# Altium schematic sheet MSU_and_periphery.SchDoc
size A4; SheetNumber: 3; SheetTotal: 3
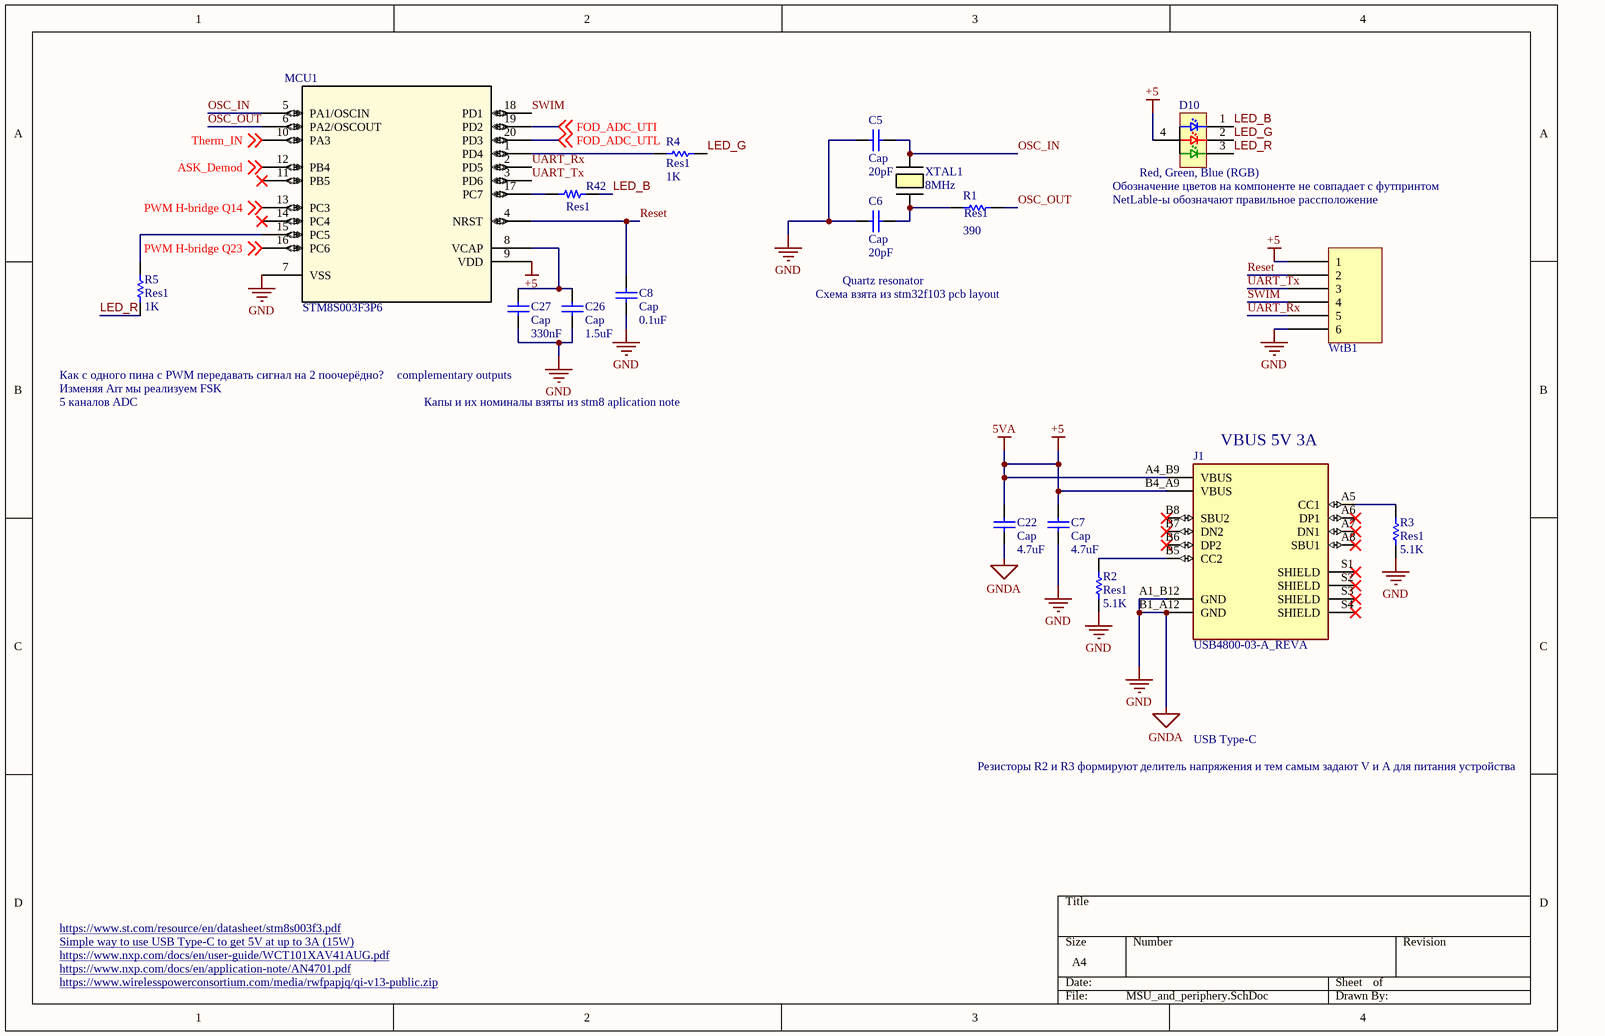
[diagram p0: MSU_and_periphery.SchDoc]

## Parts
C5  Cap  value 20pF  [CAP 0402_1005]
C6  Cap  value 20pF  [CAP 0402_1005]
C7  Cap  value 4.7uF  [CAP 0402_1005]
C8  Cap  value 0.1uF  [CAP 0402_1005]
C22  Cap  value 4.7uF  [CAP 0402_1005]
C26  Cap  value 1.5uF  [CAP 0603_1608]
C27  Cap  value 330nF  [CAP 0603_1608]
D10  Red, Green, Blue (RGB)  [Citizen CL-505S-X-SD-T]
J1  USB4800-03-A_REVA  [GCT_USB4800-03-A_REVA]
MCU1  STM8S003F3P6  [TSSOP20]
R1  Res1  value 390  [RES 0603_1608]
R2  Res1  value 5.1K  [RES 0402_1005]
R3  Res1  value 5.1K  [RES 0402_1005]
R4  Res1  value 1K  [RES 0402_1005]
R5  Res1  value 1K  [RES 0402_1005]
R42  Res1  [RES 0402_1005]
WtB1  (no value)  [6W_connector]  (no BOM)
XTAL1  8MHz  [NDK NX5032GA]

## Nets
+5: C7.1 C22.1 D10.4(A3) J1.A4_B9(VBUS) J1.B4_A9(VBUS) MCU1.9(VDD) WtB1.1  [also labelled 5VA]
GND: C5.2 C6.2 C7.2 C8.1 C22.2 C26.2 C27.1 J1.A1_B12(GND) J1.B1_A12(GND) MCU1.7(VSS) R2.2 R3.2 WtB1.6  [also labelled GNDA]
ASK_Demod: MCU1.12(PB4) ; off-sheet ASK_Demod
FOD_ADC_UTI: MCU1.19(PD2) ; off-sheet FOD_ADC_UTI
FOD_ADC_UTL: MCU1.20(PD3) ; off-sheet FOD_ADC_UTL
LED_B: D10.1(C1) R42.2
LED_G: D10.2(C2) R4.1
LED_R: D10.3(C3) R5.1
OSC_IN: C5.1 MCU1.5(PA1/OSCIN) XTAL1.1
OSC_OUT: MCU1.6(PA2/OSCOUT) R1.2
PWM H-bridge Q14: MCU1.13(PC3) ; off-sheet PWM H-bridge Q14
PWM H-bridge Q23: MCU1.16(PC6) ; off-sheet PWM H-bridge Q23
Reset: C8.2 MCU1.4(NRST) WtB1.2
SWIM: MCU1.18(PD1) WtB1.4
Therm_IN: MCU1.10(PA3) ; off-sheet Therm_IN
UART_Rx: MCU1.2(PD5) WtB1.5
UART_Tx: MCU1.3(PD6) WtB1.3
NetC6_1: C6.1 R1.1 XTAL1.2
NetC26_1: C26.1 C27.2 MCU1.8(VCAP)
NetJ1_A5: J1.A5(CC1) R3.1
NetJ1_B5: J1.B5(CC2) R2.1
NetMCU1_1: MCU1.1(PD4) R4.2
NetMCU1_15: MCU1.15(PC5) R5.2
NetMCU1_17: MCU1.17(PC7) R42.1

Not connected (* = marked no-connect by the designer): J1 A6(DP1)* A7(DN1)* A8(SBU1)* B6(DP2)* B7(DN2)* B8(SBU2)* S1(SHIELD)* S2(SHIELD)* S3(SHIELD)* S4(SHIELD)*; MCU1 11(PB5)* 14(PC4)*

## Notes on the sheet
- (near D10) Обозначение цветов на компоненте не совпадает с футпринтом
- NetLable-ы обозначают правильное рассположение
- Схема взята из stm32f103 pcb layout
- Quartz resonator
- Как с одного пина с PWM передавать сигнал на 2 поочерёдно?
- complementary outputs
- Изменяя Arr мы реализуем FSK
- 5 каналов ADC
- Капы и их номиналы взяты из stm8 aplication note
- (near J1) VBUS 5V 3A
- Резисторы R2 и R3 формируют делитель напряжения и тем самым задают V и A для питания устройства
- USB Type-C
- https://www.nxp.com/docs/en/application-note/AN4701.pdf
- https://www.nxp.com/docs/en/user-guide/WCT101XAV41AUG.pdf
- Simple way to use USB Type-C to get 5V at up to 3A (15W) <https://forum.digikey.com/t/simple-way-to-use-usb-type-c-to-get-5v-at-up-to-3a-15w/7016>
- https://www.st.com/resource/en/datasheet/stm8s003f3.pdf
- https://www.wirelesspowerconsortium.com/media/rwfpapjq/qi-v13-public.zip

## Library data of the parts
C5-C8 C22 C26 C27 = Cap: Capacitor; Published: 8-Jun-2000; LatestRevisionDate: 17-Jul-2002; LatestRevisionNote: Re-released for DXP Platform.; PackageReference: RAD-0.3; Publisher: Altium Limited; PackageDescription: Radial Cap, Thru-Hole; 2 Leads; 0.3 in Pin Spacing
D10 = CL-505S-X-SD-T: LED TRI TOP FIRING 1.0 X 1.0; Manufacturer: Citizen; Configuration: Common Anode; Current - Test: 5mA Red, 5mA Green, 5mA Blue; Lens Color: 0.26mm; Lens Size: 1.00mm; Lens Style: Square with Flat Top; Millicandela Rating: 40mcd Red, 220mcd Green, 65mcd Blue; Voltage - Forward (Vf) (Typ): 1.85V Red, 2.7V Green, 2.75V Blue; Wavelength - Dominant: 615nm Red, 530nm Green, 470nm Blue; Part Number: CL-505S-X-SD-T; Color: Red, Green, Blue (RGB); ComponentLink1Description: Datasheet; ComponentLink1URL: http://ce.citizen.co.jp/up_img/product/sQNrj4RlM7o2/CL-505S_e.pdf; ComponentLink2Description: DigiKey Link; ComponentLink2URL: http://digikey.com/product-detail/en/citizen/CL-505S-X-SD-T/1642-1510-1-ND/6005950; Device Package: 0404 (1010 Metric); Height (Max): 0.26mm; LastUpdated: 19.03.2020 22:25:23; Lifecycle Status: Active; Minimum Order: 1; Mounting Type: Surface Mount; Package / Case: 0404 (1010 Metric); Packaging: TapeAndReel; PartId: 955; Part Status: Active; Price: 0.23; Series: CL-505S; Size / Dimension: 1.00mm L x 1.00mm W; Supplier 1: DigiKey; Supplier Part Number 1: 1642-1510-1-ND; Value: Red, Green, Blue (RGB)
J1 = USB4800-03-A_REVA: USB-C (USB TYPE-C) USB 2.0 Receptacle Connector 24 (16+8 Dummy) Position Surface Mount, Right Angle; Through Hole; MF: Global Connector Technology; SnapEDA_Link: https://www.snapeda.com/parts/USB4800-03-A/Global+Connector+Technology/view-part/?ref=snap; Package: None; MP: USB4800-03-A; Check_prices: https://www.snapeda.com/parts/USB4800-03-A/Global+Connector+Technology/view-part/?ref=eda; Purchase-URL: https://pricing.snapeda.com/search/part/USB4800-03-A/?ref=eda; Price: None; Value: *; Availability: In Stock
MCU1 = STM8S003F3P6: No Description Available; Mfr_Name: STMicroelectronics; RefDes: RefDes; Type: Type
R1-R5 = Res1: Resistor; Published: 8-Jun-2000; LatestRevisionDate: 17-Jul-2002; LatestRevisionNote: Re-released for DXP Platform.; PackageReference: AXIAL-0.3; Publisher: Altium Limited; PackageDescription: Axial Device, Thru-Hole; 2 Leads; 0.3 in Pin Spacing
R42 = 5112: 0402 JUMPER ON TAPE AND REEL; Manufacturer: Keystone Electronics; Power (Watts): 0.5W, 1/2W; Part Number: 5112; ComponentLink1Description: Datasheet; ComponentLink1URL: http://www.keystoneelectronics.net/ENG._DEPT/WEB_ORACLE/PDF/PDF%20CAT%20NO%20DRAWINGS/5000-5999/5112.PDF; ComponentLink2Description: DigiKey Link; ComponentLink2URL: http://digikey.com/product-detail/en/keystone-electronics/5112/36-5112-1-ND/9921855; Composition: Metal Element; Device Package: 0402 (1005 Metric); Height - Seated (Max): 0.020" (0.50mm); LastUpdated: 02.09.2020 1:07:49; Lifecycle Status: Active; Minimum Order: 1; Number of Terminations: 2; Package / Case: 0402 (1005 Metric); Packaging: TapeAndReel; PartId: 12597; Part Status: Active; Price: 0.19; Series: -; Size / Dimension: 0.039" L x 0.020" W (1.00mm x 0.50mm); Supplier 1: DigiKey; Supplier Part Number 1: 36-5112-1-ND; Supplier Device Package: 0402; Tolerance: Jumper
WtB1 = WtB_6_connector: Wire to board connector 6pin
XTAL1 = ECS-80-18-5PX-TR